# Altium schematic sheet commu.SchDoc
size A4
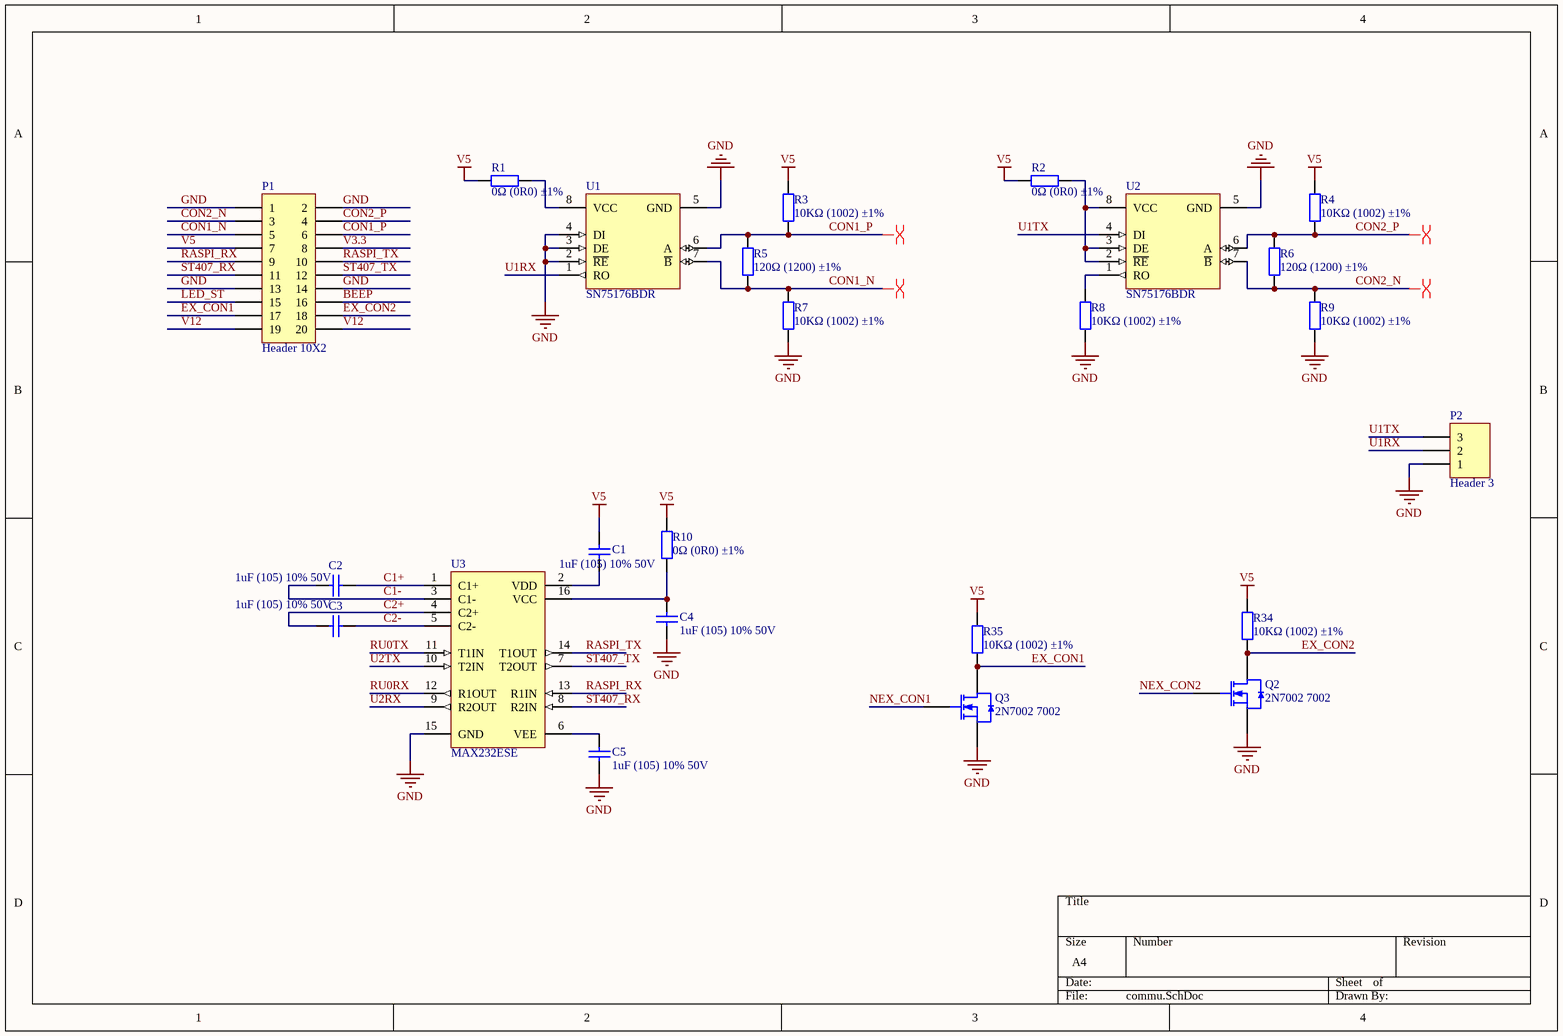
[diagram p0: commu.SchDoc]

## Parts
C1  1uF (105) 10% 50V  [0603_C]
C2  1uF (105) 10% 50V  [0603_C]
C3  1uF (105) 10% 50V  [0603_C]
C4  1uF (105) 10% 50V  [0603_C]
C5  1uF (105) 10% 50V  [0603_C]
P1  Header 10X2  [HDR2X10]
P2  Header 3  [HDR1X3]
Q2  2N7002 7002  [SOT-23(SOT-23-3)]
Q3  2N7002 7002  [SOT-23(SOT-23-3)]
R1  0Ω (0R0) ±1%  [1206_R]
R2  0Ω (0R0) ±1%  [1206_R]
R3  10KΩ (1002) ±1%  [0603_R]
R4  10KΩ (1002) ±1%  [0603_R]
R5  120Ω (1200) ±1%  [0603_R]
R6  120Ω (1200) ±1%  [0603_R]
R7  10KΩ (1002) ±1%  [0603_R]
R8  10KΩ (1002) ±1%  [0603_R]
R9  10KΩ (1002) ±1%  [0603_R]
R10  0Ω (0R0) ±1%  [1206_R]
R34  10KΩ (1002) ±1%  [0603_R]
R35  10KΩ (1002) ±1%  [0603_R]
U1  SN75176BDR  [SOIC-8_150mil]
U2  SN75176BDR  [SOIC-8_150mil]
U3  MAX232ESE  [SOIC-16_150mil]

## Nets
GND: C4.1 C5.1 P1.1 P1.2 P1.13 P1.14 P2.1 Q2.2(S) Q3.2(S) R7.1 R8.1 R9.1 U1.2(~{RE}) U1.3(DE) U1.4(DI) U1.5(GND) U2.5(GND) U3.15(GND)
V5: C1.2 P1.7 R1.1 R2.1 R3.2 R4.2 R10.2 R34.2 R35.2
BEEP: P1.16
C1+: C2.2 U3.1(C1+)
C1-: C2.1 U3.3(C1-)
C2+: C3.1 U3.4(C2+)
C2-: C3.2 U3.5(C2-)
CON1_N: P1.5 R5.1 R7.2 U1.7(~{B})
CON1_P: P1.6 R3.1 R5.2 U1.6(A)
CON2_N: P1.3 R6.1 R9.2 U2.7(~{B})
CON2_P: P1.4 R4.1 R6.2 U2.6(A)
EX_CON1: P1.17 Q3.3(D) R35.1
EX_CON2: P1.18 Q2.3(D) R34.1
LED_ST: P1.15
NEX_CON1: Q3.1(G)
NEX_CON2: Q2.1(G)
RASPI_RX: P1.9 U3.13(R1IN)
RASPI_TX: P1.10 U3.14(T1OUT)
RU0RX: U3.12(R1OUT)
RU0TX: U3.11(T1IN)
ST407_RX: P1.11 U3.8(R2IN)
ST407_TX: P1.12 U3.7(T2OUT)
U1RX: P2.2 U1.1(RO)
U1TX: P2.3 U2.4(DI)
U2RX: U3.9(R2OUT)
U2TX: U3.10(T2IN)
V3.3: P1.8
V12: P1.19 P1.20
NetC1_1: C1.1 U3.2(VDD)
NetC4_2: C4.2 R10.1 U3.16(VCC)
NetC5_2: C5.2 U3.6(VEE)
NetR1_2: R1.2 U1.8(VCC)
NetR2_2: R2.2 U2.2(~{RE}) U2.3(DE) U2.8(VCC)
NetR8_2: R8.2 U2.1(RO)

## Layout directives
differential pair: CON1_N, CON1_P, CON2_N, CON2_P

## Library data of the parts
C1-C5 = 0603 1uF (105) 10% 50V: 贴片电容; ComponentLink1Description: 供应商链接; ComponentLink1URL: http://www.szlcsc.com/product/details_16531.html; Package: 0603; Supplier: LC; SuppliersPartNumber: C15849
P1 = Header 10X2: Header, 10-Pin, Dual row; LatestRevisionDate: 17-Jul-2002; LatestRevisionNote: Re-released for DXP Platform.; Publisher: Altium Limited
P2 = Header 3: Header, 3-Pin; LatestRevisionDate: 17-Jul-2002; LatestRevisionNote: Re-released for DXP Platform.; Publisher: Altium Limited
Q2 Q3 = 2N7002 7002: MOS(场效应管); ComponentLink1Description: 供应商链接; ComponentLink1URL: http://www.szlcsc.com/product/details_9040.html; Package: SOT-23(SOT-23-3); Supplier: LC; SuppliersPartNumber: C8545
R1 R2 R10 = 1206 0Ω (0R0) 1%: 贴片电阻; ComponentLink1Description: 供应商链接; ComponentLink1URL: http://www.szlcsc.com/product/details_18576.html; Package: 1206; Supplier: LC; SuppliersPartNumber: C17888
R3 R4 R7-R9 R34 R35 = 0603 10KΩ (1002) 1%: 贴片电阻; ComponentLink1Description: 供应商链接; ComponentLink1URL: http://www.szlcsc.com/product/details_26547.html; Package: 0603; Supplier: LC; SuppliersPartNumber: C25804
R5 R6 = 0603 120Ω (1200) 1%: 贴片电阻; ComponentLink1Description: 供应商链接; ComponentLink1URL: http://www.szlcsc.com/product/details_23514.html; Package: 0603; Supplier: LC; SuppliersPartNumber: C22787
U1 U2 = SN75176BDR_[C7063]: RS-485/RS-422; ComponentLink1Description: 供应商链接; ComponentLink1URL: http://www.szlcsc.com/product/details_7535.html; Package: SOIC-8_150mil; Supplier: LC; SuppliersPartNumber: C7063
U3 = MAX232ESE_[C26860]: RS232; ComponentLink1Description: 供应商链接; ComponentLink1URL: http://www.szlcsc.com/product/details_27608.html; Package: SOIC-16_150mil; Supplier: LC; SuppliersPartNumber: C26860